# Altium schematic sheet micro.SchDoc
size A4
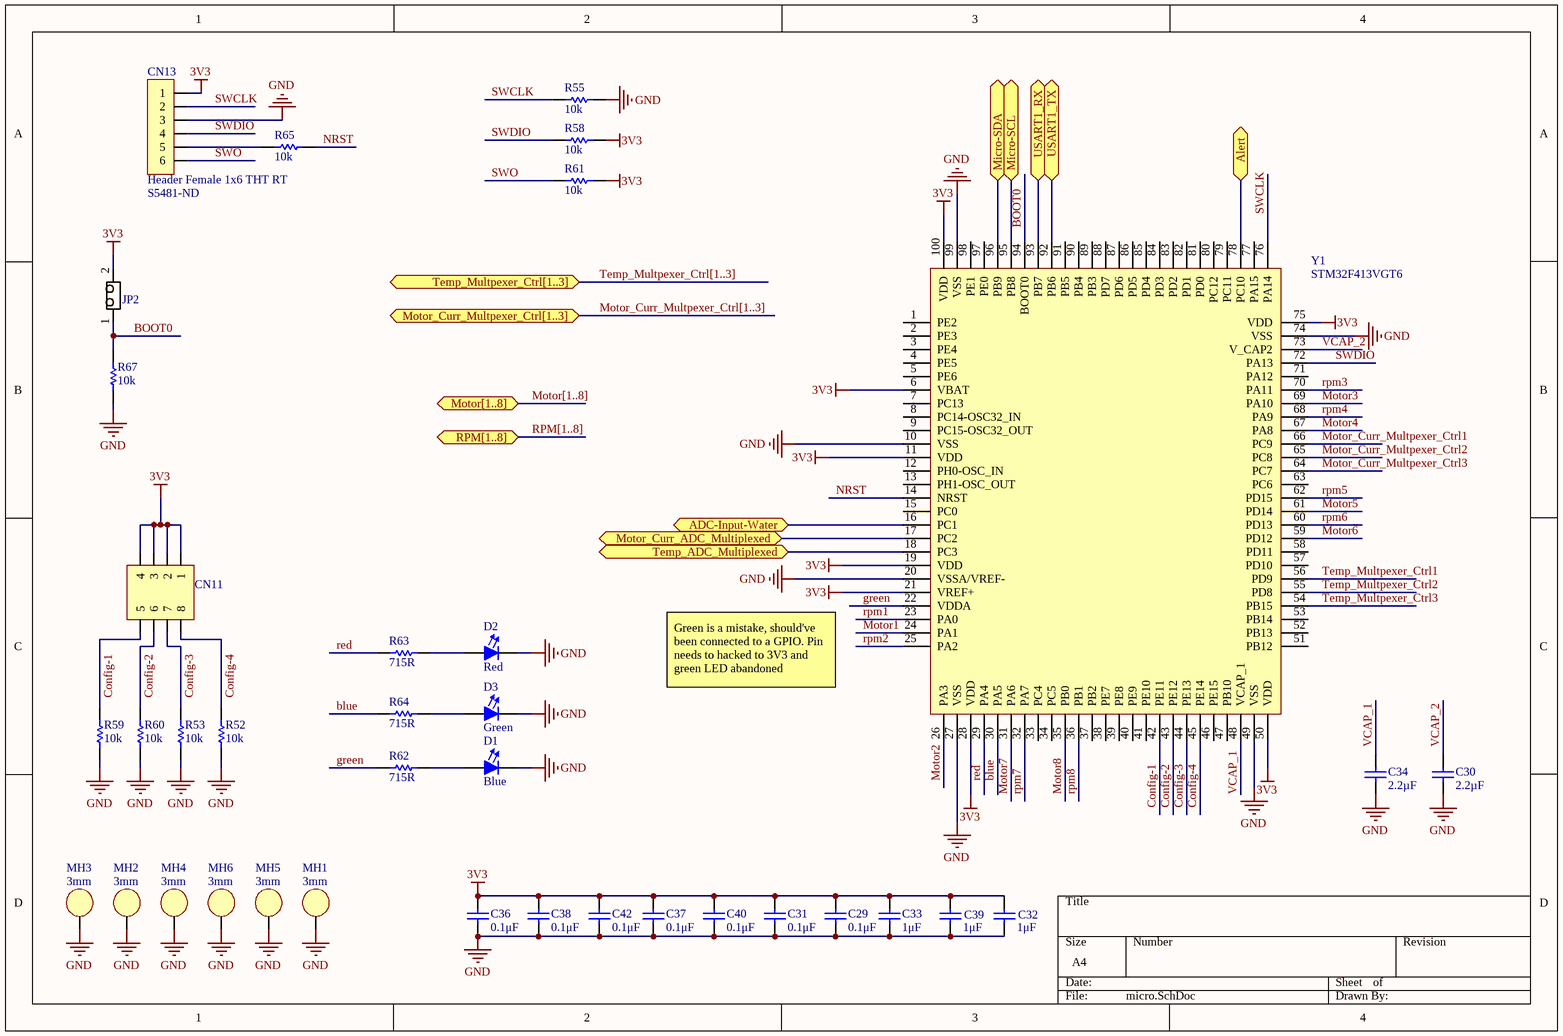
[diagram p0: micro.SchDoc]

## Parts
C29  0.1μF  [CAPC1608N(0603")]
C30  2.2µF  [CAPC1608N(0603")]
C31  0.1μF  [CAPC1608N(0603")]
C32  1μF  [CAPC1608N(0603")]
C33  1μF  [CAPC1608N(0603")]
C34  2.2µF  [CAPC1608N(0603")]
C36  0.1μF  [CAPC1608N(0603")]
C37  0.1μF  [CAPC1608N(0603")]
C38  0.1μF  [CAPC1608N(0603")]
C39  1μF  [CAPC1608N(0603")]
C40  0.1μF  [CAPC1608N(0603")]
C42  0.1μF  [CAPC1608N(0603")]
CN11  Header, Male, 2x4, Pitch: 0.1" (2.54mm), THT  [Header, Male, 2x4, Pitch: 0.1" (2.54mm),THT]  (value not drawn)
CN13  Header Female 1x6 THT RT  Supplier Part Number 1: S5481-ND  [Header, Female, RT Ang, 0.1", 1X6]
D1  Blue  [LED0805]
D2  Red  [LED0805]
D3  Green  [LED0805]
JP2  1X2 Pin Head  [2X1 Males Header]  (value not drawn)
MH1  3mm  [Mount-Hole_3mm]
MH2  3mm  [Mount-Hole_3mm]
MH3  3mm  [Mount-Hole_3mm]
MH4  3mm  [Mount-Hole_3mm]
MH5  3mm  [Mount-Hole_3mm]
MH6  3mm  [Mount-Hole_3mm]
R52  10k  [RESC1608N(0603")]
R53  10k  [RESC1608N(0603")]
R55  10k  [RESC1608N(0603")]
R58  10k  [RESC1608N(0603")]
R59  10k  [RESC1608N(0603")]
R60  10k  [RESC1608N(0603")]
R61  10k  [RESC1608N(0603")]
R62  715R  [RESC1608N(0603")]
R63  715R  [RESC1608N(0603")]
R64  715R  [RESC1608N(0603")]
R65  10k  [RESC1608N(0603")]
R67  10k  [RESC1608N(0603")]
Y1  STM32F413VGT6  [STM-LQFP100_M]

## Ports
ADC-Input-Water, Alert, Micro-SCL, Micro-SDA, Motor[1..8], Motor_Curr_ADC_Multiplexed, Motor_Curr_Multpexer_Ctrl[1..3], RPM[1..8], Temp_ADC_Multiplexed, Temp_Multpexer_Ctrl[1..3], USART1_RX, USART1_TX

## Nets
3V3: C29.2(Cathode) C31.2(Cathode) C32.2(Cathode) C33.2(Cathode) C36.2(Cathode) C37.2(Cathode) C38.2(Cathode) C39.2(Cathode) C40.2(Cathode) C42.2(Cathode) CN11.1 CN11.2 CN11.3 CN11.4 CN13.1 JP2.2 R58.2 R61.2 Y1.6(VBAT) Y1.11(VDD) Y1.19(VDD) Y1.21(VREF+) Y1.28(VDD) Y1.50(VDD) Y1.75(VDD) Y1.100(VDD)
GND: C29.1(Anode) C30.1(Anode) C31.1(Anode) C32.1(Anode) C33.1(Anode) C34.1(Anode) C36.1(Anode) C37.1(Anode) C38.1(Anode) C39.1(Anode) C40.1(Anode) C42.1(Anode) CN13.3 D1.1(Cathode) D2.1(Cathode) D3.1(Cathode) MH1.1 MH2.1 MH3.1 MH4.1 MH5.1 MH6.1 R52.1 R53.1 R55.1 R59.1 R60.1 R67.1 Y1.10(VSS) Y1.20(VSSA/VREF-) Y1.27(VSS) Y1.49(VSS) Y1.74(VSS) Y1.99(VSS)
ADC-Input-Water: Y1.16(PC1) ; port ADC-Input-Water
Alert: Y1.78(PC10) ; port Alert
blue: R64.2 Y1.30(PA5)
BOOT0: JP2.1 R67.2 Y1.94(BOOT0)
Config-1: CN11.5 R59.2 Y1.42(PE11)
Config-2: CN11.6 R60.2 Y1.43(PE12)
Config-3: CN11.7 R53.2 Y1.44(PE13)
Config-4: CN11.8 R52.2 Y1.45(PE14)
green: R62.2 Y1.22(VDDA)
Micro-SCL: Y1.95(PB8) ; port Micro-SCL
Micro-SDA: Y1.96(PB9) ; port Micro-SDA
Motor1: Y1.24(PA1)
Motor2: Y1.26(PA3)
Motor3: Y1.69(PA10)
Motor4: Y1.67(PA8)
Motor5: Y1.61(PD14)
Motor6: Y1.59(PD12)
Motor7: Y1.31(PA6)
Motor8: Y1.35(PB0)
Motor_Curr_ADC_Multiplexed: Y1.17(PC2) ; port Motor_Curr_ADC_Multiplexed
Motor_Curr_Multpexer_Ctrl1: Y1.66(PC9)
Motor_Curr_Multpexer_Ctrl2: Y1.65(PC8)
Motor_Curr_Multpexer_Ctrl3: Y1.64(PC7)
NRST: R65.2 Y1.14(NRST)
red: R63.2 Y1.29(PA4)
rpm1: Y1.23(PA0)
rpm2: Y1.25(PA2)
rpm3: Y1.70(PA11)
rpm4: Y1.68(PA9)
rpm5: Y1.62(PD15)
rpm6: Y1.60(PD13)
rpm7: Y1.32(PA7)
rpm8: Y1.36(PB1)
SWCLK: CN13.2 R55.2 Y1.76(PA14)
SWDIO: CN13.4 R58.1 Y1.72(PA13)
SWO: CN13.6 R61.1
Temp_ADC_Multiplexed: Y1.18(PC3) ; port Temp_ADC_Multiplexed
Temp_Multpexer_Ctrl1: Y1.56(PD9)
Temp_Multpexer_Ctrl2: Y1.55(PD8)
Temp_Multpexer_Ctrl3: Y1.54(PB15)
USART1_RX: Y1.93(PB7) ; port USART1_RX
USART1_TX: Y1.92(PB6) ; port USART1_TX
VCAP_1: C34.2(Cathode) Y1.48(VCAP_1)
VCAP_2: C30.2(Cathode) Y1.73(V_CAP2)
NetCN13_5: CN13.5 R65.1
NetD1_2: D1.2(Anode) R62.1
NetD2_2: D2.2(Anode) R63.1
NetD3_2: D3.2(Anode) R64.1

Not connected (* = marked no-connect by the designer): Y1 1(PE2) 2(PE3) 3(PE4) 4(PE5) 5(PE6) 7(PC13) 8(PC14-OSC32_IN) 9(PC15-OSC32_OUT) 12(PH0-OSC_IN) 13(PH1-OSC_OUT) 15(PC0) 33(PC4) 34(PC5) 37(PB2) 38(PE7) 39(PE8) 40(PE9) 41(PE10) 46(PE15) 47(PB10) 51(PB12) 52(PB13) 53(PB14) 57(PD10) 58(PD11) 63(PC6) 71(PA12) 77(PA15) 79(PC11) 80(PC12) 81(PD0) 82(PD1) 83(PD2) 84(PD3) 85(PD4) 86(PD5) 87(PD6) 88(PD7) 89(PB3) 90(PB4) 91(PB5) 97(PE0) 98(PE1)

## Buses and harness runs
bus Motor[1..8] = port Motor[1..8]
bus Motor_Curr_Multpexer_Ctrl[1..3] = port Motor_Curr_Multpexer_Ctrl[1..3]
bus RPM[1..8] = port RPM[1..8]
bus Temp_Multpexer_Ctrl[1..3] = port Temp_Multpexer_Ctrl[1..3]

## Notes on the sheet
- Green is a mistake, should've been connected to a GPIO. Pin needs to hacked to 3V3 and green LED abandoned

## Library data of the parts
C29 C31 C36-C38 C40 C42 = 0.1uF 100V 0603 SMD, Ceramic: Capacitor, Ceramic, 100V, +/- 10%, 0603 SMD, X7R; MFG: TDK; MFG#: CGA3E3X7S2A104K080AB; Published: 16-04-26; Publisher: AUVic; PackageDescription: Chip Capacitor; Value: 0.1μF; Created By: Ashwin Sira; Supplier 1: Digi-Key; Supplier Part Number 1: 445-6938-1-ND
C30 C34 = 2.2uF, 50V, 0603 SMD, X5R, Ceramic: Capacitor, Ceramic, 50V, 10%, 0603 SMD, X5R; Date Created: *; PackageDescription: Chip Capacitor; Value: 2.2µF; Made By: *; Publisher: AUVic; Supplier 1: Digi-Key; Supplier Part Number 1: 490-10733-1-ND
C32 C33 C39 = 1uF 25V 0603 SMD, Ceramic: Capacitor, Ceramic, 25V, +/- 10%, 0603 SMD, X5R; MFG: Murata-Electronics-North-America; MFG#: GRM188R61E105KA12D; Published: 16-06-27; Publisher: AUVic; PackageDescription: Chip Capacitor; Value: 1μF; Created By: Andy Bates; Supplier 1: Digi-Key; Supplier Part Number 1: 490-3897-1-ND
CN13 = Header, Female, 1x6,THT: 1x4, Pads Pitch: 0.1" (2.54mm), RT Ang, Through hole; Made Bates: Andy Bates; Supplier 1: Digi-Key
D1 = LED, 0805 (2012), Blue, Clear: Colour: Red; Created By: Ashwin Sira; Supplier 1: Digi-Key; Supplier Part Number 1: 732-4982-1-ND
D2 = LED, 0805 (2012), Red, Clear: Supplier 1: Digi-Key; Supplier Part Number 1: 732-4984-1-ND; Colour: Red; Created By: Ashwin Sira
D3 = LED, 0805 (2012), Green, Clear: Colour: Green; Created By: Andy Bates; Supplier 1: Digi-Key; Supplier Part Number 1: 475-1410-1-ND
JP2 = 1x2 Male Header: Made By: Andy Bates; Supplier 1: Digi-Key; Supplier Part Number 1: 952-3073-ND
MH1-MH6 = Mount_Hole_3mm
R52 R53 R55 R58-R61 R65 R67 = 10kR, 1%, 1/10W, 0603 SMD: Made By: Ashwin Sira; Owned By: AUVic; Created On: 14-05-31; Last Edited: 14-05-31; Supplier 1: Digi-Key; Supplier Part Number 1: 311-10.0KHRCT-ND; Value: 10k
R62-R64 = 715R, 1%, 1/10W, 0603, SMD: Created By: Ashwin Sira; Publisher: AUVic; Date Created: 2016-06-10; Value: 715R; Supplier 1: Digi-Key; Supplier Part Number 1: 541-715HCT-ND
Y1 = STM32F413VGT6: ARM Cortex-M4 32-bit MCU, 180 MHz, 320 KB Internal Rap, 81 I/O, 100-pin LQFP, -40 to 85 degC, Tray; Core Size: 32-bit; Supplier 1: Digi-Key; Supplier: Digikey; Supplier Part Number 1: 497-17009-ND
CN11 = Header, Male, 2x4, Pitch: 0.1" (2.54mm), THT: Publisher: AUVic; Date Published: 2017-09-13; Last Updated: *; Reviewed By: *; Created By: Andy Bates